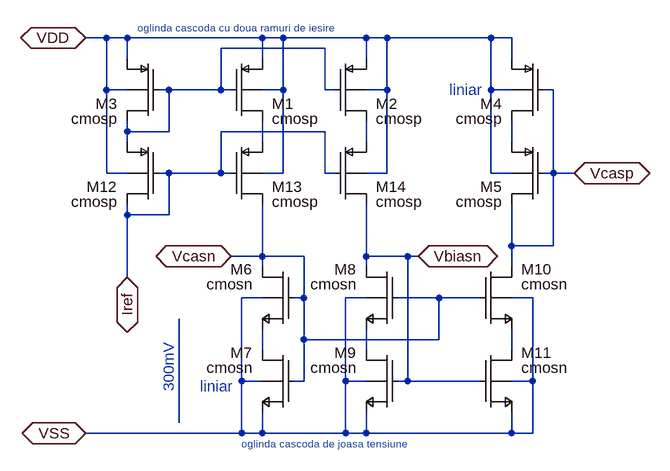
[diagram p0: schematic bias.asc]
bias.asc, the LTspice schematic file:
Version 4
SHEET 1 880 716
WIRE -144 48 -176 48
WIRE -112 48 -144 48
WIRE 96 48 -112 48
WIRE 128 48 96 48
WIRE 256 48 128 48
WIRE 288 48 256 48
WIRE 448 48 288 48
WIRE 480 48 448 48
WIRE 192 64 32 64
WIRE -112 80 -112 48
WIRE 96 80 96 48
WIRE 256 80 256 48
WIRE 480 80 480 48
WIRE -144 128 -144 48
WIRE -112 128 -144 128
WIRE -48 128 -64 128
WIRE 32 128 32 64
WIRE 32 128 -48 128
WIRE 48 128 32 128
WIRE 128 128 128 48
WIRE 128 128 96 128
WIRE 192 128 192 64
WIRE 208 128 192 128
WIRE 288 128 288 48
WIRE 288 128 256 128
WIRE 448 128 448 48
WIRE 480 128 448 128
WIRE 544 128 528 128
WIRE -112 192 -112 176
WIRE -48 192 -48 128
WIRE -48 192 -112 192
WIRE 192 192 32 192
WIRE -112 208 -112 192
WIRE 96 208 96 176
WIRE 256 208 256 176
WIRE 480 208 480 176
WIRE -144 256 -144 128
WIRE -112 256 -144 256
WIRE -48 256 -64 256
WIRE 32 256 32 192
WIRE 32 256 -48 256
WIRE 48 256 32 256
WIRE 128 256 128 128
WIRE 128 256 96 256
WIRE 192 256 192 192
WIRE 208 256 192 256
WIRE 288 256 288 128
WIRE 288 256 256 256
WIRE 448 256 448 128
WIRE 480 256 448 256
WIRE 544 256 544 128
WIRE 544 256 528 256
WIRE 576 256 544 256
WIRE -112 320 -112 304
WIRE -48 320 -48 256
WIRE -48 320 -112 320
WIRE 480 368 480 304
WIRE 544 368 544 256
WIRE 544 368 480 368
WIRE 96 384 96 304
WIRE 96 384 48 384
WIRE 160 384 96 384
WIRE 256 384 256 304
WIRE 320 384 256 384
WIRE 336 384 320 384
WIRE 96 400 96 384
WIRE 256 400 256 384
WIRE 480 400 480 368
WIRE -112 416 -112 320
WIRE 96 448 64 448
WIRE 160 448 160 384
WIRE 160 448 144 448
WIRE 256 448 224 448
WIRE 368 448 304 448
WIRE 432 448 368 448
WIRE 512 448 480 448
WIRE 160 512 160 448
WIRE 368 512 368 448
WIRE 368 512 160 512
WIRE 96 528 96 496
WIRE 256 528 256 496
WIRE 480 528 480 496
WIRE 64 576 64 448
WIRE 96 576 64 576
WIRE 160 576 160 512
WIRE 160 576 144 576
WIRE 224 576 224 448
WIRE 256 576 224 576
WIRE 320 576 320 384
WIRE 320 576 304 576
WIRE 432 576 320 576
WIRE 512 576 512 448
WIRE 512 576 480 576
WIRE -32 640 -32 480
WIRE 64 656 64 576
WIRE 64 656 -176 656
WIRE 96 656 96 624
WIRE 96 656 64 656
WIRE 224 656 224 576
WIRE 224 656 96 656
WIRE 256 656 256 624
WIRE 256 656 224 656
WIRE 480 656 480 624
WIRE 480 656 256 656
WIRE 512 656 512 576
WIRE 512 656 480 656
FLAG 336 384 Vbiasn
IOPIN 336 384 BiDir
FLAG 576 256 Vcasp
IOPIN 576 256 BiDir
FLAG 48 384 Vcasn
IOPIN 48 384 BiDir
FLAG -112 416 Iref
IOPIN -112 416 BiDir
FLAG -176 48 VDD
IOPIN -176 48 BiDir
FLAG -176 656 VSS
IOPIN -176 656 BiDir
SYMBOL pmosb 48 80 R0
SYMATTR InstName M1
SYMATTR Value cmosp
SYMATTR Value2 l=1u w=14u ad=2.8p as=2.8p pd=28.4u ps=28.4u m=1
SYMBOL pmosb 208 80 R0
SYMATTR InstName M2
SYMATTR Value cmosp
SYMATTR Value2 l=1u w=14u ad=2.8p as=2.8p pd=28.4u ps=28.4u m=1
SYMBOL pmosb -64 80 M0
SYMATTR InstName M3
SYMATTR Value cmosp
SYMATTR Value2 l=1u w=14u ad=2.8p as=2.8p pd=28.4u ps=28.4u m=1
SYMBOL pmosb 528 80 M0
SYMATTR InstName M4
SYMATTR Value cmosp
SYMATTR Value2 l=2u w=6.3u ad=1.26p as=1.26p pd=13u ps=13u m=1
SYMBOL pmosb 528 208 M0
SYMATTR InstName M5
SYMATTR Value cmosp
SYMATTR Value2 l=1u w=14u ad=2.8p as=2.8p pd=28.4u ps=28.4u m=1
SYMBOL nmosb 144 400 M0
SYMATTR InstName M6
SYMATTR Value cmosn
SYMATTR Value2 l=1u w=2.7u ad=0.54p as=0.54p pd=5.8u ps=5.8u m=1
SYMBOL nmosb 144 528 M0
SYMATTR InstName M7
SYMATTR Value cmosn
SYMATTR Value2 l=2u w=1.3u ad=0.26p as=0.26p pd=3u ps=3u m=1
SYMBOL nmosb 304 400 M0
SYMATTR InstName M8
SYMATTR Value cmosn
SYMATTR Value2 l=1u w=2.7u ad=0.54p as=0.54p pd=5.8u ps=5.8u m=1
SYMBOL nmosb 304 528 M0
SYMATTR InstName M9
SYMATTR Value cmosn
SYMATTR Value2 l=1u w=2.7u ad=0.54p as=0.54p pd=5.8u ps=5.8u m=1
SYMBOL nmosb 432 400 R0
SYMATTR InstName M10
SYMATTR Value cmosn
SYMATTR Value2 l=1u w=2.7u ad=0.54p as=0.54p pd=5.8u ps=5.8u m=1
SYMBOL nmosb 432 528 R0
SYMATTR InstName M11
SYMATTR Value cmosn
SYMATTR Value2 l=1u w=2.7u ad=0.54p as=0.54p pd=5.8u ps=5.8u m=1
SYMBOL pmosb -64 208 M0
SYMATTR InstName M12
SYMATTR Value cmosp
SYMATTR Value2 l=1u w=14u ad=2.8p as=2.8p pd=28.4u ps=28.4u m=1
SYMBOL pmosb 48 208 R0
SYMATTR InstName M13
SYMATTR Value cmosp
SYMATTR Value2 l=1u w=14u ad=2.8p as=2.8p pd=28.4u ps=28.4u m=1
SYMBOL pmosb 208 208 R0
SYMATTR InstName M14
SYMATTR Value cmosp
SYMATTR Value2 l=1u w=14u ad=2.8p as=2.8p pd=28.4u ps=28.4u m=1
TEXT 0 584 Left 2 ;liniar
TEXT 384 128 Left 2 ;liniar
TEXT -48 592 VLeft 2 ;300mV
TEXT 64 672 Left 1 ;oglinda cascoda de joasa tensiune
TEXT -96 32 Left 1 ;oglinda cascoda cu doua ramuri de iesire

The netlist it stands for:
* bias.asc
M1 N002 N001 VDD VDD cmosp l=1u w=14u ad=2.8p as=2.8p pd=28.4u ps=28.4u m=1
M2 N003 N001 VDD VDD cmosp l=1u w=14u ad=2.8p as=2.8p pd=28.4u ps=28.4u m=1
M3 N001 N001 VDD VDD cmosp l=1u w=14u ad=2.8p as=2.8p pd=28.4u ps=28.4u m=1
M4 N004 Vcasp VDD VDD cmosp l=2u w=6.3u ad=1.26p as=1.26p pd=13u ps=13u m=1
M5 Vcasp Vcasp N004 VDD cmosp l=1u w=14u ad=2.8p as=2.8p pd=28.4u ps=28.4u m=1
M6 Vcasn Vcasn N005 VSS cmosn l=1u w=2.7u ad=0.54p as=0.54p pd=5.8u ps=5.8u m=1
M7 N005 Vcasn VSS VSS cmosn l=2u w=1.3u ad=0.26p as=0.26p pd=3u ps=3u m=1
M8 Vbiasn Vcasn N006 VSS cmosn l=1u w=2.7u ad=0.54p as=0.54p pd=5.8u ps=5.8u m=1
M9 N006 Vbiasn VSS VSS cmosn l=1u w=2.7u ad=0.54p as=0.54p pd=5.8u ps=5.8u m=1
M10 Vcasp Vcasn N007 VSS cmosn l=1u w=2.7u ad=0.54p as=0.54p pd=5.8u ps=5.8u m=1
M11 N007 Vbiasn VSS VSS cmosn l=1u w=2.7u ad=0.54p as=0.54p pd=5.8u ps=5.8u m=1
M12 Iref Iref N001 VDD cmosp l=1u w=14u ad=2.8p as=2.8p pd=28.4u ps=28.4u m=1
M13 Vcasn Iref N002 VDD cmosp l=1u w=14u ad=2.8p as=2.8p pd=28.4u ps=28.4u m=1
M14 Vbiasn Iref N003 VDD cmosp l=1u w=14u ad=2.8p as=2.8p pd=28.4u ps=28.4u m=1
.model NMOS NMOS
.model PMOS PMOS
.lib standard.mos
* liniar
* liniar
* 300mV
* oglinda cascoda de joasa tensiune
* oglinda cascoda cu doua ramuri de iesire
.backanno
.end